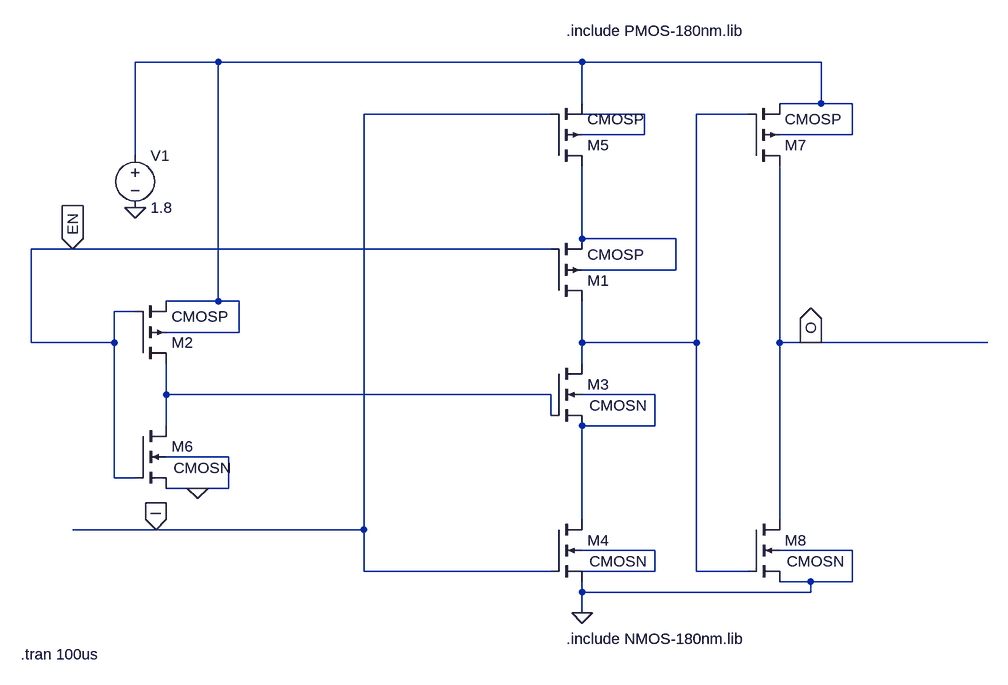
[diagram p0: schematic Tristate.asc]
Tristate.asc, the LTspice schematic file:
Version 4
SHEET 1 2520 736
WIRE -320 -192 -448 -192
WIRE 240 -192 -320 -192
WIRE 608 -192 240 -192
WIRE 240 -128 240 -192
WIRE 608 -128 608 -192
WIRE 608 -128 544 -128
WIRE 656 -128 608 -128
WIRE 192 -112 -96 -112
WIRE 336 -112 240 -112
WIRE 496 -112 416 -112
WIRE 336 -80 336 -112
WIRE 336 -80 240 -80
WIRE 656 -80 656 -128
WIRE 656 -80 544 -80
WIRE -448 -48 -448 -192
WIRE 240 80 240 -32
WIRE 384 80 240 80
WIRE -544 96 -608 96
WIRE 192 96 -544 96
WIRE 384 128 384 80
WIRE 384 128 240 128
WIRE -320 176 -320 -192
WIRE -320 176 -400 176
WIRE -288 176 -320 176
WIRE -448 192 -480 192
WIRE -288 224 -288 176
WIRE -288 224 -400 224
WIRE -608 240 -608 96
WIRE -480 240 -480 192
WIRE -480 240 -608 240
WIRE 240 240 240 176
WIRE 416 240 416 -112
WIRE 416 240 240 240
WIRE 544 240 544 -32
WIRE 592 240 544 240
WIRE 864 240 592 240
WIRE 240 272 240 240
WIRE -400 320 -400 272
WIRE 192 320 -400 320
WIRE 352 320 240 320
WIRE 192 352 192 320
WIRE -400 368 -400 320
WIRE 352 368 352 320
WIRE 352 368 240 368
WIRE -304 416 -400 416
WIRE -480 448 -480 240
WIRE -448 448 -480 448
WIRE -352 464 -400 464
WIRE -304 464 -304 416
WIRE -304 464 -352 464
WIRE 240 512 240 368
WIRE 544 512 544 240
WIRE -416 528 -544 528
WIRE -96 528 -96 -112
WIRE -96 528 -416 528
WIRE 352 560 240 560
WIRE 656 560 544 560
WIRE -96 592 -96 528
WIRE 192 592 -96 592
WIRE 352 592 352 560
WIRE 352 592 240 592
WIRE 416 592 416 240
WIRE 496 592 416 592
WIRE 592 608 544 608
WIRE 656 608 656 560
WIRE 656 608 592 608
WIRE 240 624 240 608
WIRE 592 624 592 608
WIRE 592 624 240 624
WIRE 240 656 240 624
FLAG -448 32 0
FLAG -352 464 0
FLAG 240 656 0
FLAG -544 96 EN
IOPIN -544 96 In
FLAG -416 528 I
IOPIN -416 528 In
FLAG 592 240 O
IOPIN 592 240 Out
SYMBOL voltage -448 -64 R0
WINDOW 123 0 0 Left 0
WINDOW 39 0 0 Left 0
SYMATTR InstName V1
SYMATTR Value 1.8
SYMBOL pmos4 192 176 M180
SYMATTR InstName M1
SYMATTR Value CMOSP
SYMATTR Value2 l=180n w=900n m=1
SYMBOL pmos4 -448 272 M180
SYMATTR InstName M2
SYMATTR Value CMOSP
SYMATTR Value2 l=180n w=900n m=1
SYMBOL pmos4 192 -32 M180
SYMATTR InstName M5
SYMATTR Value CMOSP
SYMATTR Value2 l=180n w=900n m=1
SYMBOL nmos4 192 272 R0
WINDOW 3 59 65 Left 2
SYMATTR Value CMOSN
SYMATTR InstName M3
SYMATTR Value2 l=180n w=360n
SYMBOL nmos4 192 512 R0
WINDOW 3 59 65 Left 2
SYMATTR Value CMOSN
SYMATTR InstName M4
SYMATTR Value2 l=180n w=360n
SYMBOL nmos4 -448 368 R0
WINDOW 3 59 65 Left 2
SYMATTR Value CMOSN
SYMATTR InstName M6
SYMATTR Value2 l=180n w=360n
SYMBOL pmos4 496 -32 M180
SYMATTR InstName M7
SYMATTR Value CMOSP
SYMATTR Value2 l=180n w=900n m=1
SYMBOL nmos4 496 512 R0
WINDOW 3 59 65 Left 2
SYMATTR Value CMOSN
SYMATTR InstName M8
SYMATTR Value2 l=180n w=360n
TEXT 216 -240 Left 2 !.include PMOS-180nm.lib
TEXT 216 696 Left 2 !.include NMOS-180nm.lib
TEXT -624 720 Left 2 !.tran 100us

The netlist it stands for:
* Tristate.asc
V1 N001 0 1.8
M1 N003 EN N004 N004 CMOSP l=180n w=900n m=1
M2 N005 EN N001 N001 CMOSP l=180n w=900n m=1
M5 N004 I N001 N002 CMOSP l=180n w=900n m=1
M3 N003 N005 N006 N006 CMOSN l=180n w=360n
M4 N006 I 0 N007 CMOSN l=180n w=360n
M6 N005 EN 0 0 CMOSN l=180n w=360n
M7 O N003 N001 N001 CMOSP l=180n w=900n m=1
M8 O N003 0 0 CMOSN l=180n w=360n
.model NMOS NMOS
.model PMOS PMOS
.lib standard.mos
.include PMOS-180nm.lib
.include NMOS-180nm.lib
.tran 100us
.backanno
.end